# Altium schematic sheet Sensors.SchDoc
size A; SheetNumber: 3; SheetTotal: 4
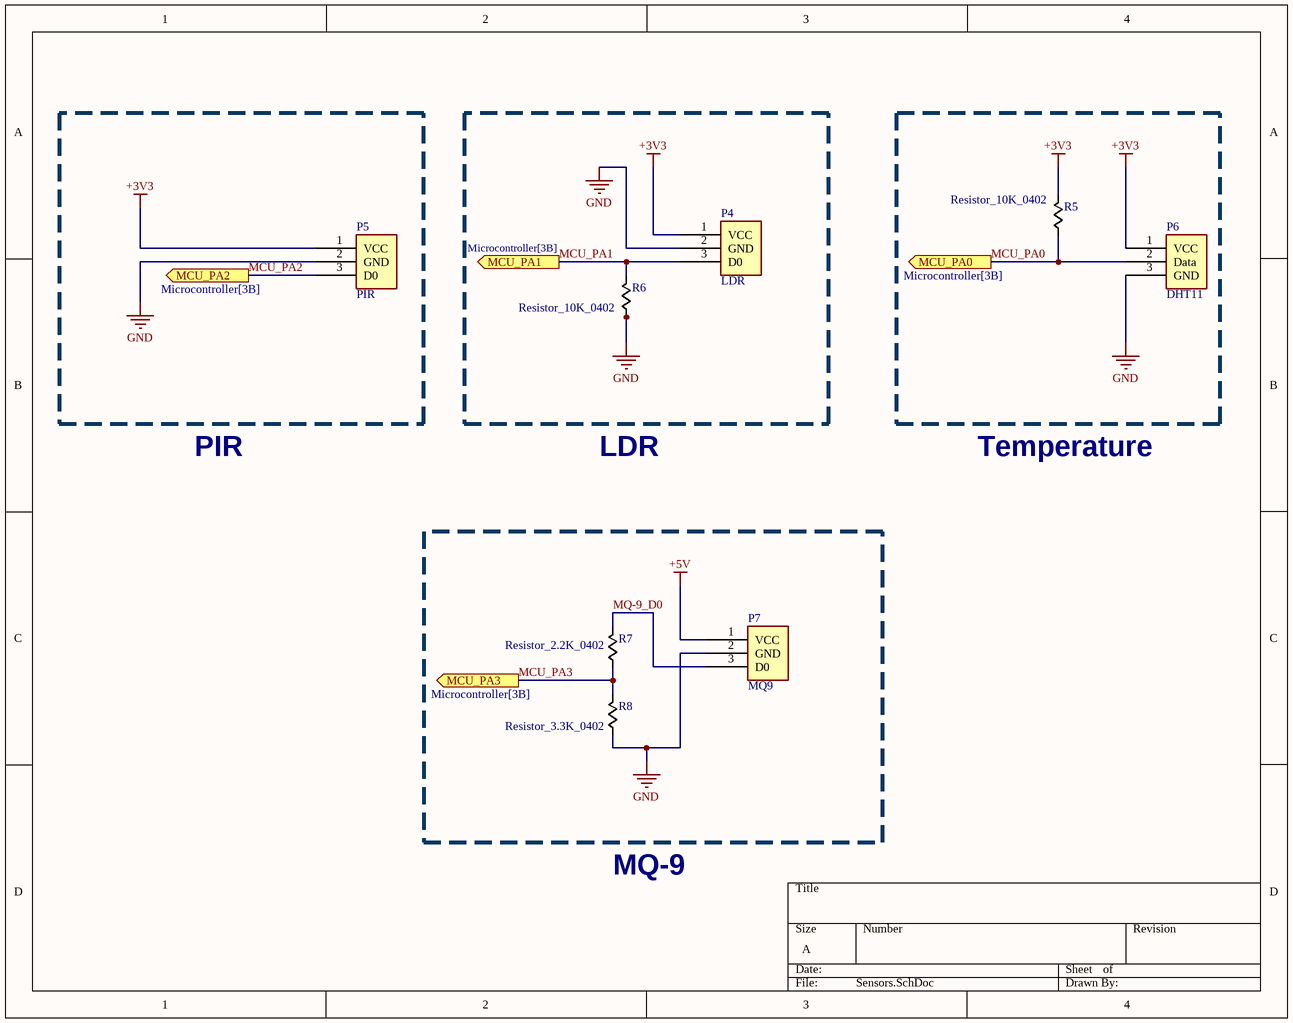
[diagram p0: Sensors.SchDoc]

## Parts
P4  LDR  [HEADER 1x3 MALE]
P5  PIR  [HEADER 1x3 MALE]
P6  DHT11  [HEADER 1x3 MALE]
P7  MQ9  [HEADER 1x3 MALE]
R5  Resistor_10K_0402  [RESC1005X40N]
R6  Resistor_10K_0402  [RESC1005X40N]
R7  Resistor_2.2K_0402  [RESC1005X40N]
R8  Resistor_3.3K_0402  [RESC1005X40N]

## Ports
MCU_PA0 (out, see Microcontroller[3B]), MCU_PA1 (out, see Microcontroller[3B]), MCU_PA2 (out, see Microcontroller[3B]), MCU_PA3 (out, see Microcontroller[3B])

## Nets
+3V3: P4.1(VCC) P5.1(VCC) P6.1(VCC) R5.2
+5V: P7.1(VCC)
GND: P4.2(GND) P5.2(GND) P6.3(GND) P7.2(GND) R6.1 R8.1
MCU_PA0: P6.2(Data) R5.1 ; port MCU_PA0
MCU_PA1: P4.3(D0) R6.2 ; port MCU_PA1
MCU_PA2: P5.3(D0) ; port MCU_PA2
MCU_PA3: R7.1 R8.2 ; port MCU_PA3
MQ-9_D0: P7.3(D0) R7.2

## Notes on the sheet
- PIR
- LDR
- Temperature
- MQ-9

## Library data of the parts
P4 = Header 1x3-LDR: The LDR Light Sensor Module detects light intensity, with resistance decreasing as light increases. Ideal for automatic lighting and brightness sensing.; Supplier: Makers Electronics; Supplier Part#: 300000009413; ComponentLink1Description: Link; ComponentLink1URL: https://makerselectronics.com/product/ldr-light-sensor-module/
P5 = Header 1x3-PIR: AM312  is a compact PIR motion sensor (HW-740) that detects motion up to 5 m with ultra-low power consumption for battery-powered projects.automatic lighting and brightness sensing.; Supplier: Makers Electronics; Supplier Part#: 3496300110674; ComponentLink1Description: Link; ComponentLink1URL: https://makerselectronics.com/product/am312-mini-pir-motion-sensor-module/
P6 = Header 1x3-DHT Temp: DHT11 Temperature Humidity Sensor Board measures temperature (0–50°C) and humidity (20–90%) with digital output, ideal for weather monitoring, IoT, automation.; Supplier: Makers Electronics; Supplier Part#: 300000009298; ComponentLink1Description: Link; ComponentLink1URL: https://makerselectronics.com/product/dht11-board/
P7 = Header 1x3-MQ9: MQ-9 is a compact and versatile gas sensor module for detecting carbon monoxide and combustible gases.; Supplier: Makers Electronics; Supplier Part#: 300000009267; ComponentLink1Description: Link; ComponentLink1URL: https://makerselectronics.com/product/mq-9-carbon-monoxide-gas-sensor/
R5 R6 = Resistor_10K_0402: RES 10kΩ ±1% 62.5mW 0402; Manufacturer: YAGEO; Manufacturer Part #: RC0402FR-0710KL; Supplier: LCSC; Supplier Part #: C60490; ComponentLink1Description: Data Sheet; ComponentLink1URL: https://www.lcsc.com/datasheet/C60490.pdf?spm=wm.sxq.inf.ggs___wm.fly.bg.1.stp&lcsc_vid=T1MKV1cAE1gLBAVfTgIKUgJfTlkPBQBVQlMMBAJURwAxVlNeT1dcVVBSRVlfUDsOAxUeFF5JWBYZEEoKFBINSQcJGk4NBhADEA4cHktXRlhXSQwSGg0%3D
R7 = Resistor_2.2K_0402: 2.2kOhms Â±1% 0.063W, 1/16W Chip Resistor 0402 (1005 Metric) Moisture Resistant Thick Film; Manufacturer: FOJAN; Manufacturer Part #: RC0402FR-071KL; Supplier: LCSC; Supplier Part #: C106235; ComponentLink1Description: Data Sheet; ComponentLink1URL: https://www.lcsc.com/datasheet/C106235.pdf?spm=wm.sxq.inf.ggs___wm.fly.bg.2.stp&lcsc_vid=T1MKV1cAE1gLBAVfTgIKUgJfTlkPBQBVQlMMBAJURwAxVlNeT1dcVlJVRFlZVzsOAxUeFF5JWBYZEEoKFBINSQcJGk4NBhADEA4cHktXRlhXSQwSGg0%3D
R8 = Resistor_3.3K_0402: RES 3.3kΩ ±1% 62.5mW 0402; Manufacturer: YAGEO; Manufacturer Part #: RC0402FR-074K7L; Supplier: LCSC; Supplier Part #: C105871; ComponentLink1Description: Data Sheet; ComponentLink1URL: https://www.lcsc.com/datasheet/C105871.pdf?spm=wm.sxq.inf.ggs___wm.fly.bg.0.stp&lcsc_vid=RFcPU1ZSEVdeBFReRgUKAgZXQAMKBQJURFUIAwVSQVgxVlNeT1dXUFZUTldcVjsOAxUeFF5JWBYZEEoKFBINSQcJGk4NBhADEA4cHktXR1BYSQwSGg0%3D